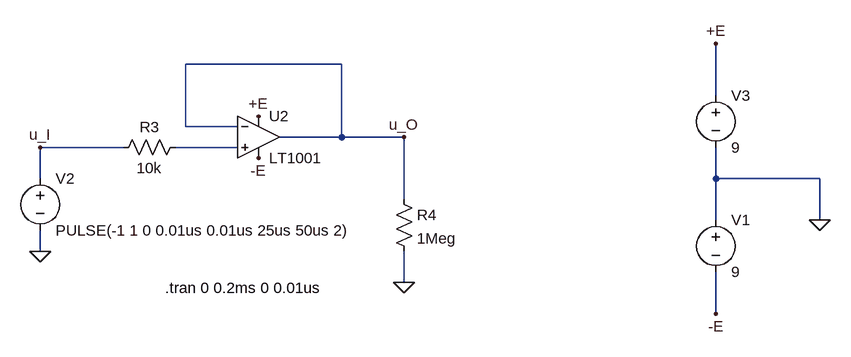
[diagram p0: schematic OpAmp.asc]
OpAmp.asc, the LTspice schematic file:
Version 4
SHEET 1 964 680
WIRE 208 -624 -32 -624
WIRE 784 -576 784 -656
WIRE -32 -528 -32 -624
WIRE 48 -528 -32 -528
WIRE 208 -512 208 -624
WIRE 208 -512 112 -512
WIRE 304 -512 208 -512
WIRE -128 -496 -256 -496
WIRE 48 -496 -48 -496
WIRE -256 -448 -256 -496
WIRE 784 -448 784 -496
WIRE 944 -448 784 -448
WIRE 304 -416 304 -512
WIRE 784 -384 784 -448
WIRE 944 -384 944 -448
WIRE -256 -336 -256 -368
WIRE 304 -288 304 -336
WIRE 784 -240 784 -304
FLAG -256 -336 0
FLAG 304 -288 0
FLAG -256 -496 u_I
FLAG 304 -512 u_O
FLAG 944 -384 0
FLAG 784 -240 -E
FLAG 784 -656 +E
FLAG 80 -480 -E
FLAG 80 -544 +E
SYMBOL OpAmps\\LT1001 80 -576 R0
SYMATTR InstName U2
SYMBOL res -32 -512 R90
WINDOW 0 0 56 VBottom 2
WINDOW 3 32 56 VTop 2
SYMATTR InstName R3
SYMATTR Value 10k
SYMBOL voltage -256 -464 R0
WINDOW 123 0 0 Left 0
WINDOW 39 0 0 Left 0
SYMATTR InstName V2
SYMATTR Value PULSE(-1 1 0 0.01us 0.01us 25us 50us 2)
SYMBOL res 288 -432 R0
SYMATTR InstName R4
SYMATTR Value 1Meg
SYMBOL voltage 784 -400 R0
WINDOW 123 0 0 Left 0
WINDOW 39 0 0 Left 0
SYMATTR InstName V1
SYMATTR Value 9
SYMBOL voltage 784 -592 R0
WINDOW 123 0 0 Left 0
WINDOW 39 0 0 Left 0
SYMATTR InstName V3
SYMATTR Value 9
TEXT -64 -280 Left 2 !.tran 0 0.2ms 0 0.01us

The netlist it stands for:
* OpAmp.asc
XU2 N001 u_O +E -E u_O LT1001  ; pins In+ In- V+ V- OUT
R3 N001 u_I 10k
V2 u_I 0 PULSE(-1 1 0 0.01us 0.01us 25us 50us 2)
R4 u_O 0 1Meg
V1 0 -E 9
V3 +E 0 9
.tran 0 0.2ms 0 0.01us
.lib LTC.lib
.backanno
.end